# Altium schematic sheet Dice Module.SchDoc
size A4
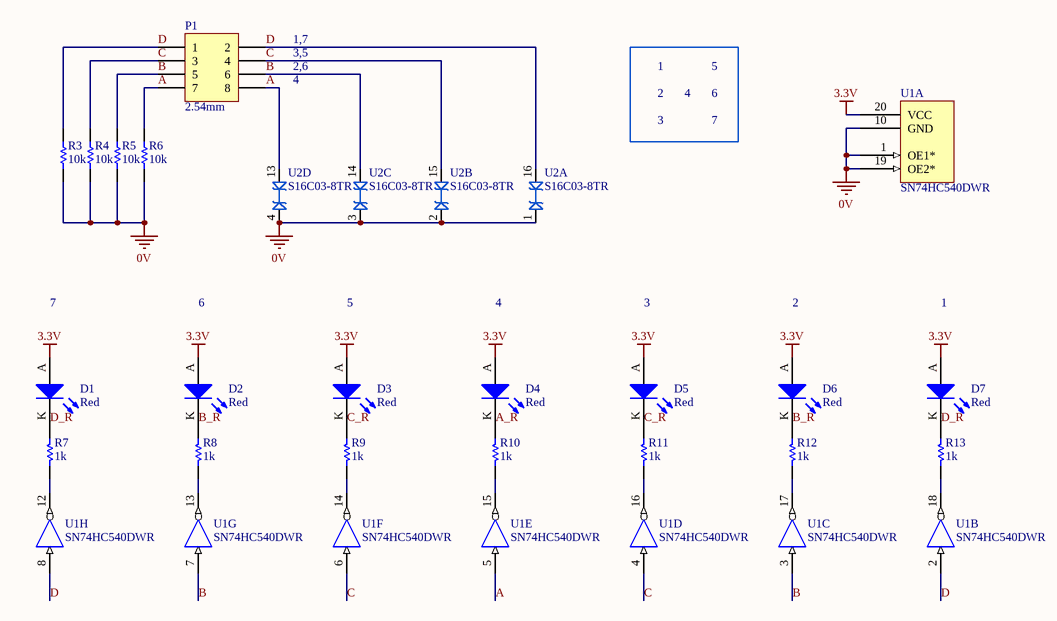
[diagram p0: Dice Module.SchDoc]

## Parts
D1  Red  [0805 LED]
D2  Red  [0805 LED]
D3  Red  [0805 LED]
D4  Red  [0805 LED]
D5  Red  [0805 LED]
D6  Red  [0805 LED]
D7  Red  [0805 LED]
P1  2.54mm  [Header 2x4]
R3  10k  [0805]
R4  10k  [0805]
R5  10k  [0805]
R6  10k  [0805]
R7  1k  [0805]
R8  1k  [0805]
R9  1k  [0805]
R10  1k  [0805]
R11  1k  [0805]
R12  1k  [0805]
R13  1k  [0805]
U1  SN74HC540DWR  [TI 20-SOIC]  (parts A,B,C,D,E,F,G,H of 9)
U2  S16C03-8TR  [SMC 16-SOIC]  (parts A,B,C,D of 8)

## Nets
0V: R3.1 R4.1 R5.1 R6.1 U1.1(OE1*) U1.10(GND) U1.19(OE2*) U2.1(A) U2.2(A) U2.3(A) U2.4(A)
3.3V: D1.A D2.A D3.A D4.A D5.A D6.A D7.A U1.20(VCC)
A: P1.7 P1.8 R6.2 U1.5(A4) U2.13(A)
A_R: D4.K R10.1
B: P1.5 P1.6 R5.2 U1.3(A2) U1.7(A6) U2.14(A)
B_R: D2.K D6.K R8.1 R12.1
C: P1.3 P1.4 R4.2 U1.4(A3) U1.6(A5) U2.15(A)
C_R: D3.K D5.K R9.1 R11.1
D: P1.1 P1.2 R3.2 U1.2(A1) U1.8(A7) U2.16(A)
D_R: D1.K D7.K R7.1 R13.1
NetR7_2: R7.2 U1.12(Y7)
NetR8_2: R8.2 U1.13(Y6)
NetR9_2: R9.2 U1.14(Y5)
NetR10_2: R10.2 U1.15(Y5)
NetR11_2: R11.2 U1.16(Y3)
NetR12_2: R12.2 U1.17(Y2)
NetR13_2: R13.2 U1.18(Y1)

## Notes on the sheet
- 1,7
- 3,5
- 2,6
- 4
- 1
- 2
- 5
- 6
- 3
- 7
- Title
- Size:
- Date:
- A4
- Number:
- Time:
- Revision:
- Sheet
- of
- File:

## Library data of the parts
D1-D7 = SML-210LTT86: Red LED Indication - Discrete 1.75V 0805 (2012 Metric); Manufacturer: ROHM Semiconductor; Part Number: SML-210LTT86; Colour: Red; Digikey Part Number: 511-1286-1-ND; Digikey Link: https://www.digikey.com/product-detail/en/rohm-semiconductor/SML-210LTT86/511-1286-1-ND/637099
P1 = Header 2x4: Positions: 8; Angle: 0; Flange: No; Contact: NA; Part Number: Header 2x4; Pitch: 2.54mm; Row Spacing: 2.54mm
R3-R6 = RC0805FR0710KL: Manufacturer: YAGEO; Tolerance: 0.01; Rated Voltage: 0.125W; Part Number: RC0805FR0710KL; Value: 10k; Material: FR-07; qty: 50
R7-R13 = RC0805FR071KL: Manufacturer: YAGEO; Tolerance: 0.01; Rated Voltage: 0.125W; Part Number: RC0805FR071KL; Value: 1k; Material: FR-07; qty: 50
U1 = SN74HC540DWR: IC BUFFER INVERT 6V 20SOIC; Manufacturer: Texas Instruments; Part Number: SN74HC540DWR; Digikey Part Number: 296-8333-1-ND; Digikey Link: https://www.digikey.com/product-detail/en/texas-instruments/SN74HC540DWR/296-8333-1-ND/376710
U2 = S16C03-8TR: PD 300W VWM 3.3VCJ 425PFPACKAGE; Manufacturer: SMC Diode; Part Number: S16C03-8TR; Digikey Part Number: 1655-2152-2-ND; Digikey Link: https://www.digikey.com/product-detail/en/smc-diode-solutions/S16C03-8TR/1655-2152-2-ND/9816814